# Altium schematic sheet Outputs.SchDoc
size A4
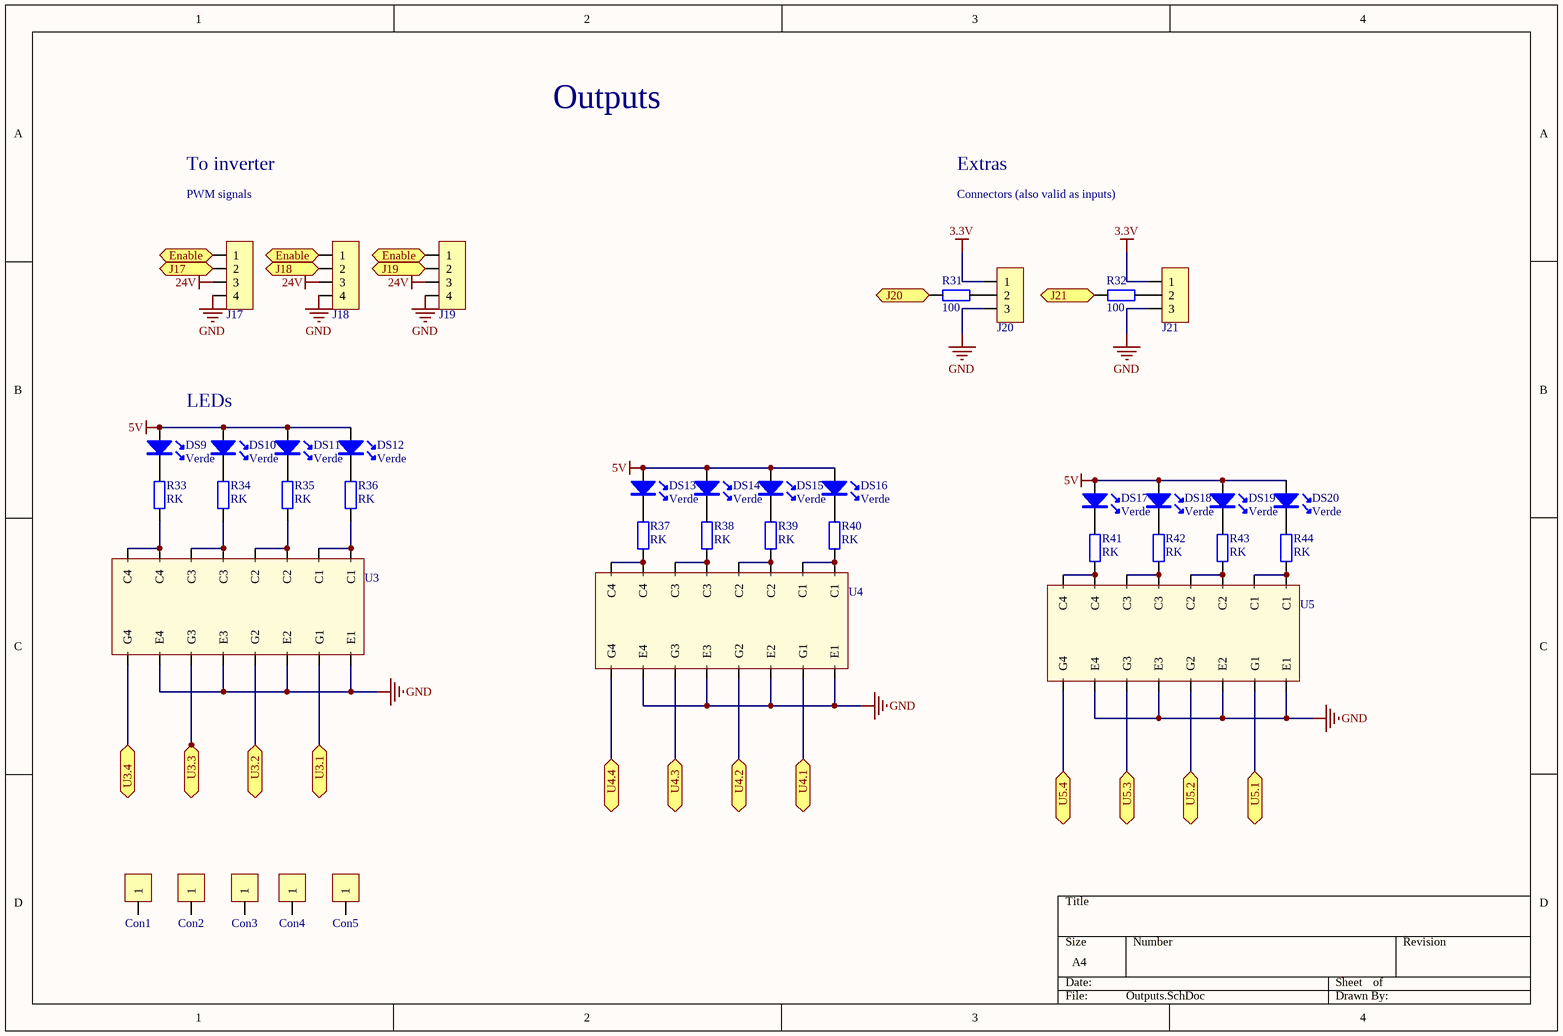
[diagram p0: Outputs.SchDoc]

## Parts
Con1  CON1  [Support]  (value not drawn)
Con2  CON1  [Support]  (value not drawn)
Con3  CON1  [Support]  (value not drawn)
Con4  CON1  [Support]  (value not drawn)
Con5  CON1  [Support]  (value not drawn)
DS9  Verde  [LED_100mil]
DS10  Verde  [LED_100mil]
DS11  Verde  [LED_100mil]
DS12  Verde  [LED_100mil]
DS13  Verde  [LED_100mil]
DS14  Verde  [LED_100mil]
DS15  Verde  [LED_100mil]
DS16  Verde  [LED_100mil]
DS17  Verde  [LED_100mil]
DS18  Verde  [LED_100mil]
DS19  Verde  [LED_100mil]
DS20  Verde  [LED_100mil]
J17  Cleva 2 vias  [Con4_KK_256]  (value not drawn)
J18  Cleva 2 vias  [Con4_KK_256]  (value not drawn)
J19  Cleva 2 vias  [Con4_KK_256]  (value not drawn)
J20  Cleva 2 vias  [Con3_KK_256]  (value not drawn)
J21  Cleva 2 vias  [Con3_KK_256]  (value not drawn)
R31  100  [1206]
R32  100  [1206]
R33  RK  [1206]
R34  RK  [1206]
R35  RK  [1206]
R36  RK  [1206]
R37  RK  [1206]
R38  RK  [1206]
R39  RK  [1206]
R40  RK  [1206]
R41  RK  [1206]
R42  RK  [1206]
R43  RK  [1206]
R44  RK  [1206]
U3  MMPQ3904  [SO-16]  (value not drawn)
U4  MMPQ3904  [SO-16]  (value not drawn)
U5  MMPQ3904  [SO-16]  (value not drawn)

## Ports
Enable, J17, J18, J19, J20, J21, U3.1, U3.2, U3.3, U3.4, U4.1, U4.2, U4.3, U4.4, U5.1, U5.2, U5.3, U5.4

## Nets
3.3V: J20.1 J21.1
5V: DS9.A DS10.A DS11.A DS12.A DS13.A DS14.A DS15.A DS16.A DS17.A DS18.A DS19.A DS20.A
24V: J17.3 J18.3 J19.3
GND: J17.4 J18.4 J19.4 J20.3 J21.3 U3.10(E4) U3.12(E3) U3.14(E2) U3.16(E1) U4.10(E4) U4.12(E3) U4.14(E2) U4.16(E1) U5.10(E4) U5.12(E3) U5.14(E2) U5.16(E1)
Enable: J17.1 J18.1 J19.1 ; port Enable
J17: J17.2 ; port J17
J18: J18.2 ; port J18
J19: J19.2 ; port J19
J20: R31.1 ; port J20
J21: R32.1 ; port J21
U3.1: U3.15(G1) ; port U3.1
U3.2: U3.13(G2) ; port U3.2
U3.3: U3.11(G3) ; port U3.3
U3.4: U3.9(G4) ; port U3.4
U4.1: U4.15(G1) ; port U4.1
U4.2: U4.13(G2) ; port U4.2
U4.3: U4.11(G3) ; port U4.3
U4.4: U4.9(G4) ; port U4.4
U5.1: U5.15(G1) ; port U5.1
U5.2: U5.13(G2) ; port U5.2
U5.3: U5.11(G3) ; port U5.3
U5.4: U5.9(G4) ; port U5.4
NetDS9_K: DS9.K R33.1
NetDS10_K: DS10.K R34.1
NetDS11_K: DS11.K R35.1
NetDS12_K: DS12.K R36.1
NetDS13_K: DS13.K R37.1
NetDS14_K: DS14.K R38.1
NetDS15_K: DS15.K R39.1
NetDS16_K: DS16.K R40.1
NetDS17_K: DS17.K R41.1
NetDS18_K: DS18.K R42.1
NetDS19_K: DS19.K R43.1
NetDS20_K: DS20.K R44.1
NetJ20_2: J20.2 R31.2
NetJ21_2: J21.2 R32.2
NetR33_2: R33.2 U3.7(C4) U3.8(C4)
NetR34_2: R34.2 U3.5(C3) U3.6(C3)
NetR35_2: R35.2 U3.3(C2) U3.4(C2)
NetR36_2: R36.2 U3.1(C1) U3.2(C1)
NetR37_2: R37.2 U4.7(C4) U4.8(C4)
NetR38_2: R38.2 U4.5(C3) U4.6(C3)
NetR39_2: R39.2 U4.3(C2) U4.4(C2)
NetR40_2: R40.2 U4.1(C1) U4.2(C1)
NetR41_2: R41.2 U5.7(C4) U5.8(C4)
NetR42_2: R42.2 U5.5(C3) U5.6(C3)
NetR43_2: R43.2 U5.3(C2) U5.4(C2)
NetR44_2: R44.2 U5.1(C1) U5.2(C1)

Not connected (* = marked no-connect by the designer): Con1 1; Con2 1; Con3 1; Con4 1; Con5 1

## Notes on the sheet
- Outputs
- To inverter
- Extras
- (near J17) PWM signals
- Connectors (also valid as inputs)
- LEDs

## Library data of the parts
DS9-DS20 = Led
J17-J19 = Con_4
J20 J21 = Con_3
R31-R44 = Resistencia: Potencia: 1/4W